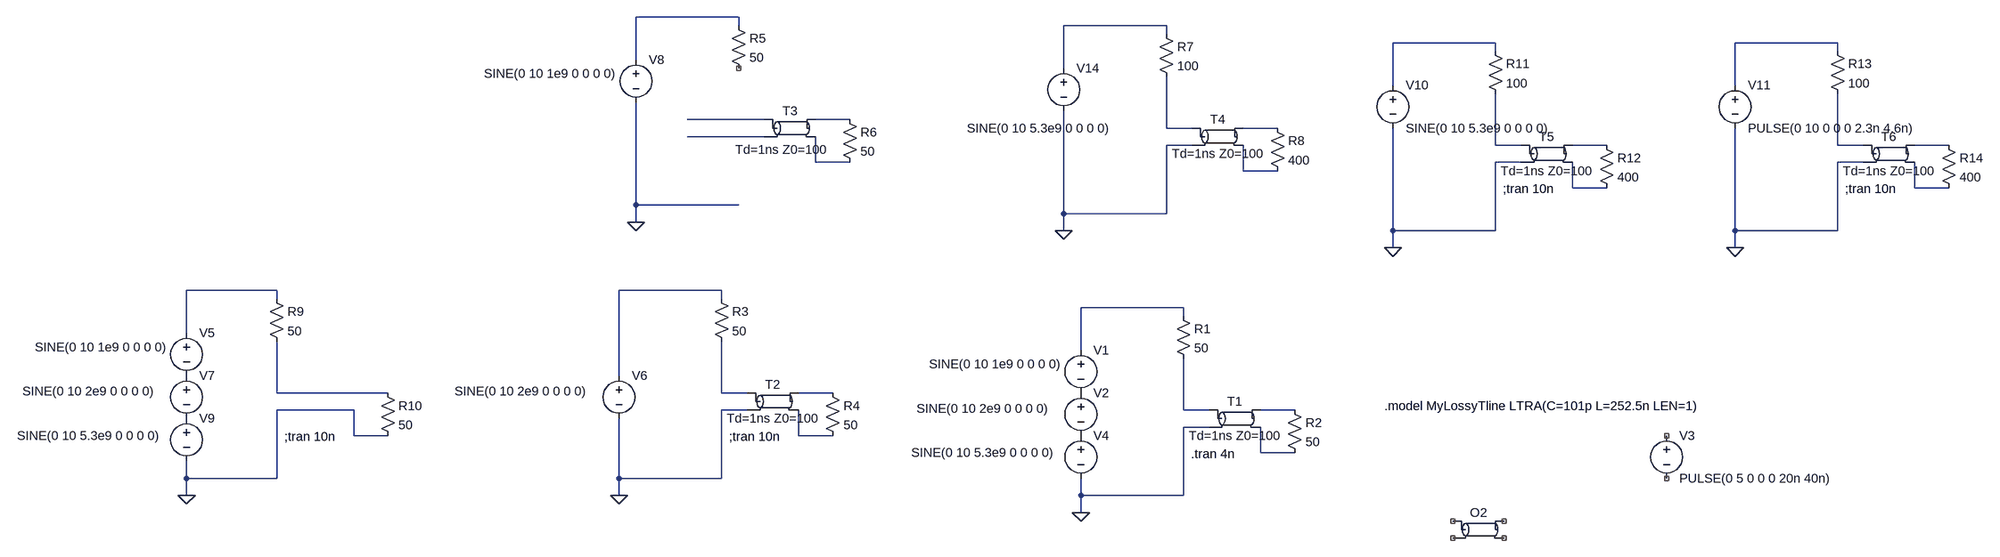
[diagram p0: schematic reflection_simulator.asc]
reflection_simulator.asc, the LTspice schematic file:
Version 4
SHEET 1 1348 680
WIRE -1072 -912 -1264 -912
WIRE -1072 -896 -1072 -912
WIRE -272 -896 -464 -896
WIRE -272 -880 -272 -896
WIRE 432 -864 240 -864
WIRE 1072 -864 880 -864
WIRE 432 -848 432 -864
WIRE 1072 -848 1072 -864
WIRE -1264 -832 -1264 -912
WIRE -464 -816 -464 -896
WIRE 240 -784 240 -864
WIRE 880 -784 880 -864
WIRE -1024 -720 -1168 -720
WIRE -864 -720 -928 -720
WIRE -272 -704 -272 -800
WIRE -224 -704 -272 -704
WIRE -64 -704 -128 -704
WIRE -1024 -688 -1168 -688
WIRE -224 -672 -272 -672
WIRE 432 -672 432 -768
WIRE 480 -672 432 -672
WIRE 640 -672 576 -672
WIRE 1072 -672 1072 -768
WIRE 1120 -672 1072 -672
WIRE 1280 -672 1216 -672
WIRE -928 -640 -928 -688
WIRE -864 -640 -928 -640
WIRE 480 -640 432 -640
WIRE 1120 -640 1072 -640
WIRE -128 -624 -128 -672
WIRE -64 -624 -128 -624
WIRE 576 -592 576 -640
WIRE 640 -592 576 -592
WIRE 1216 -592 1216 -640
WIRE 1280 -592 1216 -592
WIRE -1264 -560 -1264 -752
WIRE -1072 -560 -1264 -560
WIRE -464 -544 -464 -736
WIRE -272 -544 -272 -672
WIRE -272 -544 -464 -544
WIRE -1264 -528 -1264 -560
WIRE -464 -512 -464 -544
WIRE 240 -512 240 -704
WIRE 432 -512 432 -640
WIRE 432 -512 240 -512
WIRE 880 -512 880 -704
WIRE 1072 -512 1072 -640
WIRE 1072 -512 880 -512
WIRE 240 -480 240 -512
WIRE 880 -480 880 -512
WIRE -1936 -400 -2128 -400
WIRE -1104 -400 -1296 -400
WIRE -1936 -384 -1936 -400
WIRE -1104 -384 -1104 -400
WIRE -240 -368 -432 -368
WIRE -240 -352 -240 -368
WIRE -2128 -320 -2128 -400
WIRE -432 -288 -432 -368
WIRE -1296 -240 -1296 -400
WIRE -1936 -208 -1936 -304
WIRE -1728 -208 -1936 -208
WIRE -1104 -208 -1104 -304
WIRE -1056 -208 -1104 -208
WIRE -896 -208 -960 -208
WIRE -1792 -176 -1936 -176
WIRE -1056 -176 -1104 -176
WIRE -240 -176 -240 -272
WIRE -192 -176 -240 -176
WIRE -32 -176 -96 -176
WIRE -192 -144 -240 -144
WIRE -1792 -128 -1792 -176
WIRE -1728 -128 -1792 -128
WIRE -960 -128 -960 -176
WIRE -896 -128 -960 -128
WIRE -96 -96 -96 -144
WIRE -32 -96 -96 -96
WIRE -2128 -48 -2128 -80
WIRE -1936 -48 -1936 -176
WIRE -1936 -48 -2128 -48
WIRE -1296 -48 -1296 -160
WIRE -1104 -48 -1104 -176
WIRE -1104 -48 -1296 -48
WIRE -2128 -16 -2128 -48
WIRE -1296 -16 -1296 -48
WIRE -432 -16 -432 -48
WIRE -240 -16 -240 -144
WIRE -240 -16 -432 -16
WIRE -432 16 -432 -16
FLAG -432 16 0
FLAG -1296 -16 0
FLAG -1264 -528 0
FLAG -464 -512 0
FLAG -2128 -16 0
FLAG 240 -480 0
FLAG 880 -480 0
SYMBOL tline -144 -160 R0
SYMATTR InstName T1
SYMATTR Value Td=1ns Z0=100
SYMBOL voltage -432 -304 R0
WINDOW 3 -284 42 Left 2
WINDOW 123 0 0 Left 0
WINDOW 39 0 0 Left 0
SYMATTR InstName V1
SYMATTR Value SINE(0 10 1e9 0 0 0 0)
SYMBOL res -256 -368 R0
SYMATTR InstName R1
SYMATTR Value 50
SYMBOL res -48 -192 R0
SYMATTR InstName R2
SYMATTR Value 50
SYMBOL ltline 400 48 R0
SYMATTR InstName O2
SYMATTR Value ""
SYMATTR SpiceModel MyLossyTline
SYMBOL voltage 752 -144 R0
WINDOW 123 0 0 Left 0
WINDOW 39 0 0 Left 0
SYMATTR InstName V3
SYMATTR Value PULSE(0 5 0 0 0 20n 40n)
SYMBOL voltage -432 -224 R0
WINDOW 3 -307 45 Left 2
WINDOW 123 0 0 Left 0
WINDOW 39 0 0 Left 0
SYMATTR InstName V2
SYMATTR Value SINE(0 10 2e9 0 0 0 0)
SYMBOL voltage -432 -144 R0
WINDOW 3 -317 48 Left 2
WINDOW 123 0 0 Left 0
WINDOW 39 0 0 Left 0
SYMATTR InstName V4
SYMATTR Value SINE(0 10 5.3e9 0 0 0 0)
SYMBOL tline -1008 -192 R0
SYMATTR InstName T2
SYMATTR Value Td=1ns Z0=100
SYMBOL res -1120 -400 R0
SYMATTR InstName R3
SYMATTR Value 50
SYMBOL res -912 -224 R0
SYMATTR InstName R4
SYMATTR Value 50
SYMBOL voltage -1296 -256 R0
WINDOW 3 -307 45 Left 2
WINDOW 123 0 0 Left 0
WINDOW 39 0 0 Left 0
SYMATTR InstName V6
SYMATTR Value SINE(0 10 2e9 0 0 0 0)
SYMBOL tline -976 -704 R0
WINDOW 3 -16 25 Top 2
SYMATTR InstName T3
SYMATTR Value Td=1ns Z0=100
SYMBOL voltage -1264 -848 R0
WINDOW 3 -284 42 Left 2
WINDOW 123 0 0 Left 0
WINDOW 39 0 0 Left 0
SYMATTR InstName V8
SYMATTR Value SINE(0 10 1e9 0 0 0 0)
SYMBOL res -1088 -912 R0
SYMATTR InstName R5
SYMATTR Value 50
SYMBOL res -880 -736 R0
SYMATTR InstName R6
SYMATTR Value 50
SYMBOL tline -176 -688 R0
SYMATTR InstName T4
SYMATTR Value Td=1ns Z0=100
SYMBOL res -288 -896 R0
SYMATTR InstName R7
SYMATTR Value 100
SYMBOL res -80 -720 R0
SYMATTR InstName R8
SYMATTR Value 400
SYMBOL voltage -464 -832 R0
WINDOW 3 -181 128 Left 2
WINDOW 123 0 0 Left 0
WINDOW 39 0 0 Left 0
SYMATTR InstName V14
SYMATTR Value SINE(0 10 5.3e9 0 0 0 0)
SYMBOL voltage -2128 -336 R0
WINDOW 3 -284 42 Left 2
WINDOW 123 0 0 Left 0
WINDOW 39 0 0 Left 0
SYMATTR InstName V5
SYMATTR Value SINE(0 10 1e9 0 0 0 0)
SYMBOL res -1952 -400 R0
SYMATTR InstName R9
SYMATTR Value 50
SYMBOL res -1744 -224 R0
SYMATTR InstName R10
SYMATTR Value 50
SYMBOL voltage -2128 -256 R0
WINDOW 3 -307 45 Left 2
WINDOW 123 0 0 Left 0
WINDOW 39 0 0 Left 0
SYMATTR InstName V7
SYMATTR Value SINE(0 10 2e9 0 0 0 0)
SYMBOL voltage -2128 -176 R0
WINDOW 3 -317 48 Left 2
WINDOW 123 0 0 Left 0
WINDOW 39 0 0 Left 0
SYMATTR InstName V9
SYMATTR Value SINE(0 10 5.3e9 0 0 0 0)
SYMBOL tline 528 -656 R0
SYMATTR InstName T5
SYMATTR Value Td=1ns Z0=100
SYMBOL res 416 -864 R0
SYMATTR InstName R11
SYMATTR Value 100
SYMBOL res 624 -688 R0
SYMATTR InstName R12
SYMATTR Value 400
SYMBOL voltage 240 -800 R0
WINDOW 123 0 0 Left 0
WINDOW 39 0 0 Left 0
SYMATTR InstName V10
SYMATTR Value SINE(0 10 5.3e9 0 0 0 0)
SYMBOL tline 1168 -656 R0
SYMATTR InstName T6
SYMATTR Value Td=1ns Z0=100
SYMBOL res 1056 -864 R0
SYMATTR InstName R13
SYMATTR Value 100
SYMBOL res 1264 -688 R0
SYMATTR InstName R14
SYMATTR Value 400
SYMBOL voltage 880 -800 R0
WINDOW 123 0 0 Left 0
WINDOW 39 0 0 Left 0
SYMATTR InstName V11
SYMATTR Value PULSE(0 10 0 0 0 2.3n 4.6n)
TEXT -226 -94 Left 2 !.tran 4n
TEXT 224 -184 Left 2 !.model MyLossyTline LTRA(C=101p L=252.5n LEN=1)
TEXT -1090 -126 Left 2 !;tran 10n
TEXT -1922 -126 Left 2 !;tran 10n
TEXT 446 -590 Left 2 !;tran 10n
TEXT 1086 -590 Left 2 !;tran 10n

The netlist it stands for:
* reflection_simulator.asc
T1 N024 0 N025 N027 Td=1ns Z0=100
V1 N020 P001 SINE(0 10 1e9 0 0 0 0)
R1 N020 N024 50
R2 N025 N027 50
O2 NC_01 NC_02 NC_03 NC_04 MyLossyTline
V3 NC_05 NC_06 PULSE(0 5 0 0 0 20n 40n)
V2 P001 P002 SINE(0 10 2e9 0 0 0 0)
V4 P002 0 SINE(0 10 5.3e9 0 0 0 0)
T2 N022 0 N023 N026 Td=1ns Z0=100
R3 N019 N022 50
R4 N023 N026 50
V6 N019 0 SINE(0 10 2e9 0 0 0 0)
T3 N005 N009 N006 N014 Td=1ns Z0=100
V8 N001 0 SINE(0 10 1e9 0 0 0 0)
R5 N001 NC_07 50
R6 N006 N014 50
T4 N007 0 N008 N015 Td=1ns Z0=100
R7 N002 N007 100
R8 N008 N015 400
V14 N002 0 SINE(0 10 5.3e9 0 0 0 0)
V5 N018 P003 SINE(0 10 1e9 0 0 0 0)
R9 N018 N021 50
R10 N021 0 50
V7 P003 P004 SINE(0 10 2e9 0 0 0 0)
V9 P004 0 SINE(0 10 5.3e9 0 0 0 0)
T5 N010 0 N011 N016 Td=1ns Z0=100
R11 N003 N010 100
R12 N011 N016 400
V10 N003 0 SINE(0 10 5.3e9 0 0 0 0)
T6 N012 0 N013 N017 Td=1ns Z0=100
R13 N004 N012 100
R14 N013 N017 400
V11 N004 0 PULSE(0 10 0 0 0 2.3n 4.6n)
.tran 4n
.model MyLossyTline LTRA(C=101p L=252.5n LEN=1)
;tran 10n
;tran 10n
;tran 10n
;tran 10n
.backanno
.end